# EasyEDA schematic SCH_Full_BMS_2022-05-24.json
TITLE: Sheet_1; REV: 1.0; Date: 2021-12-19; Sheet: 1/1; Drawn By: Сергей Давиденко; Company: Your Company
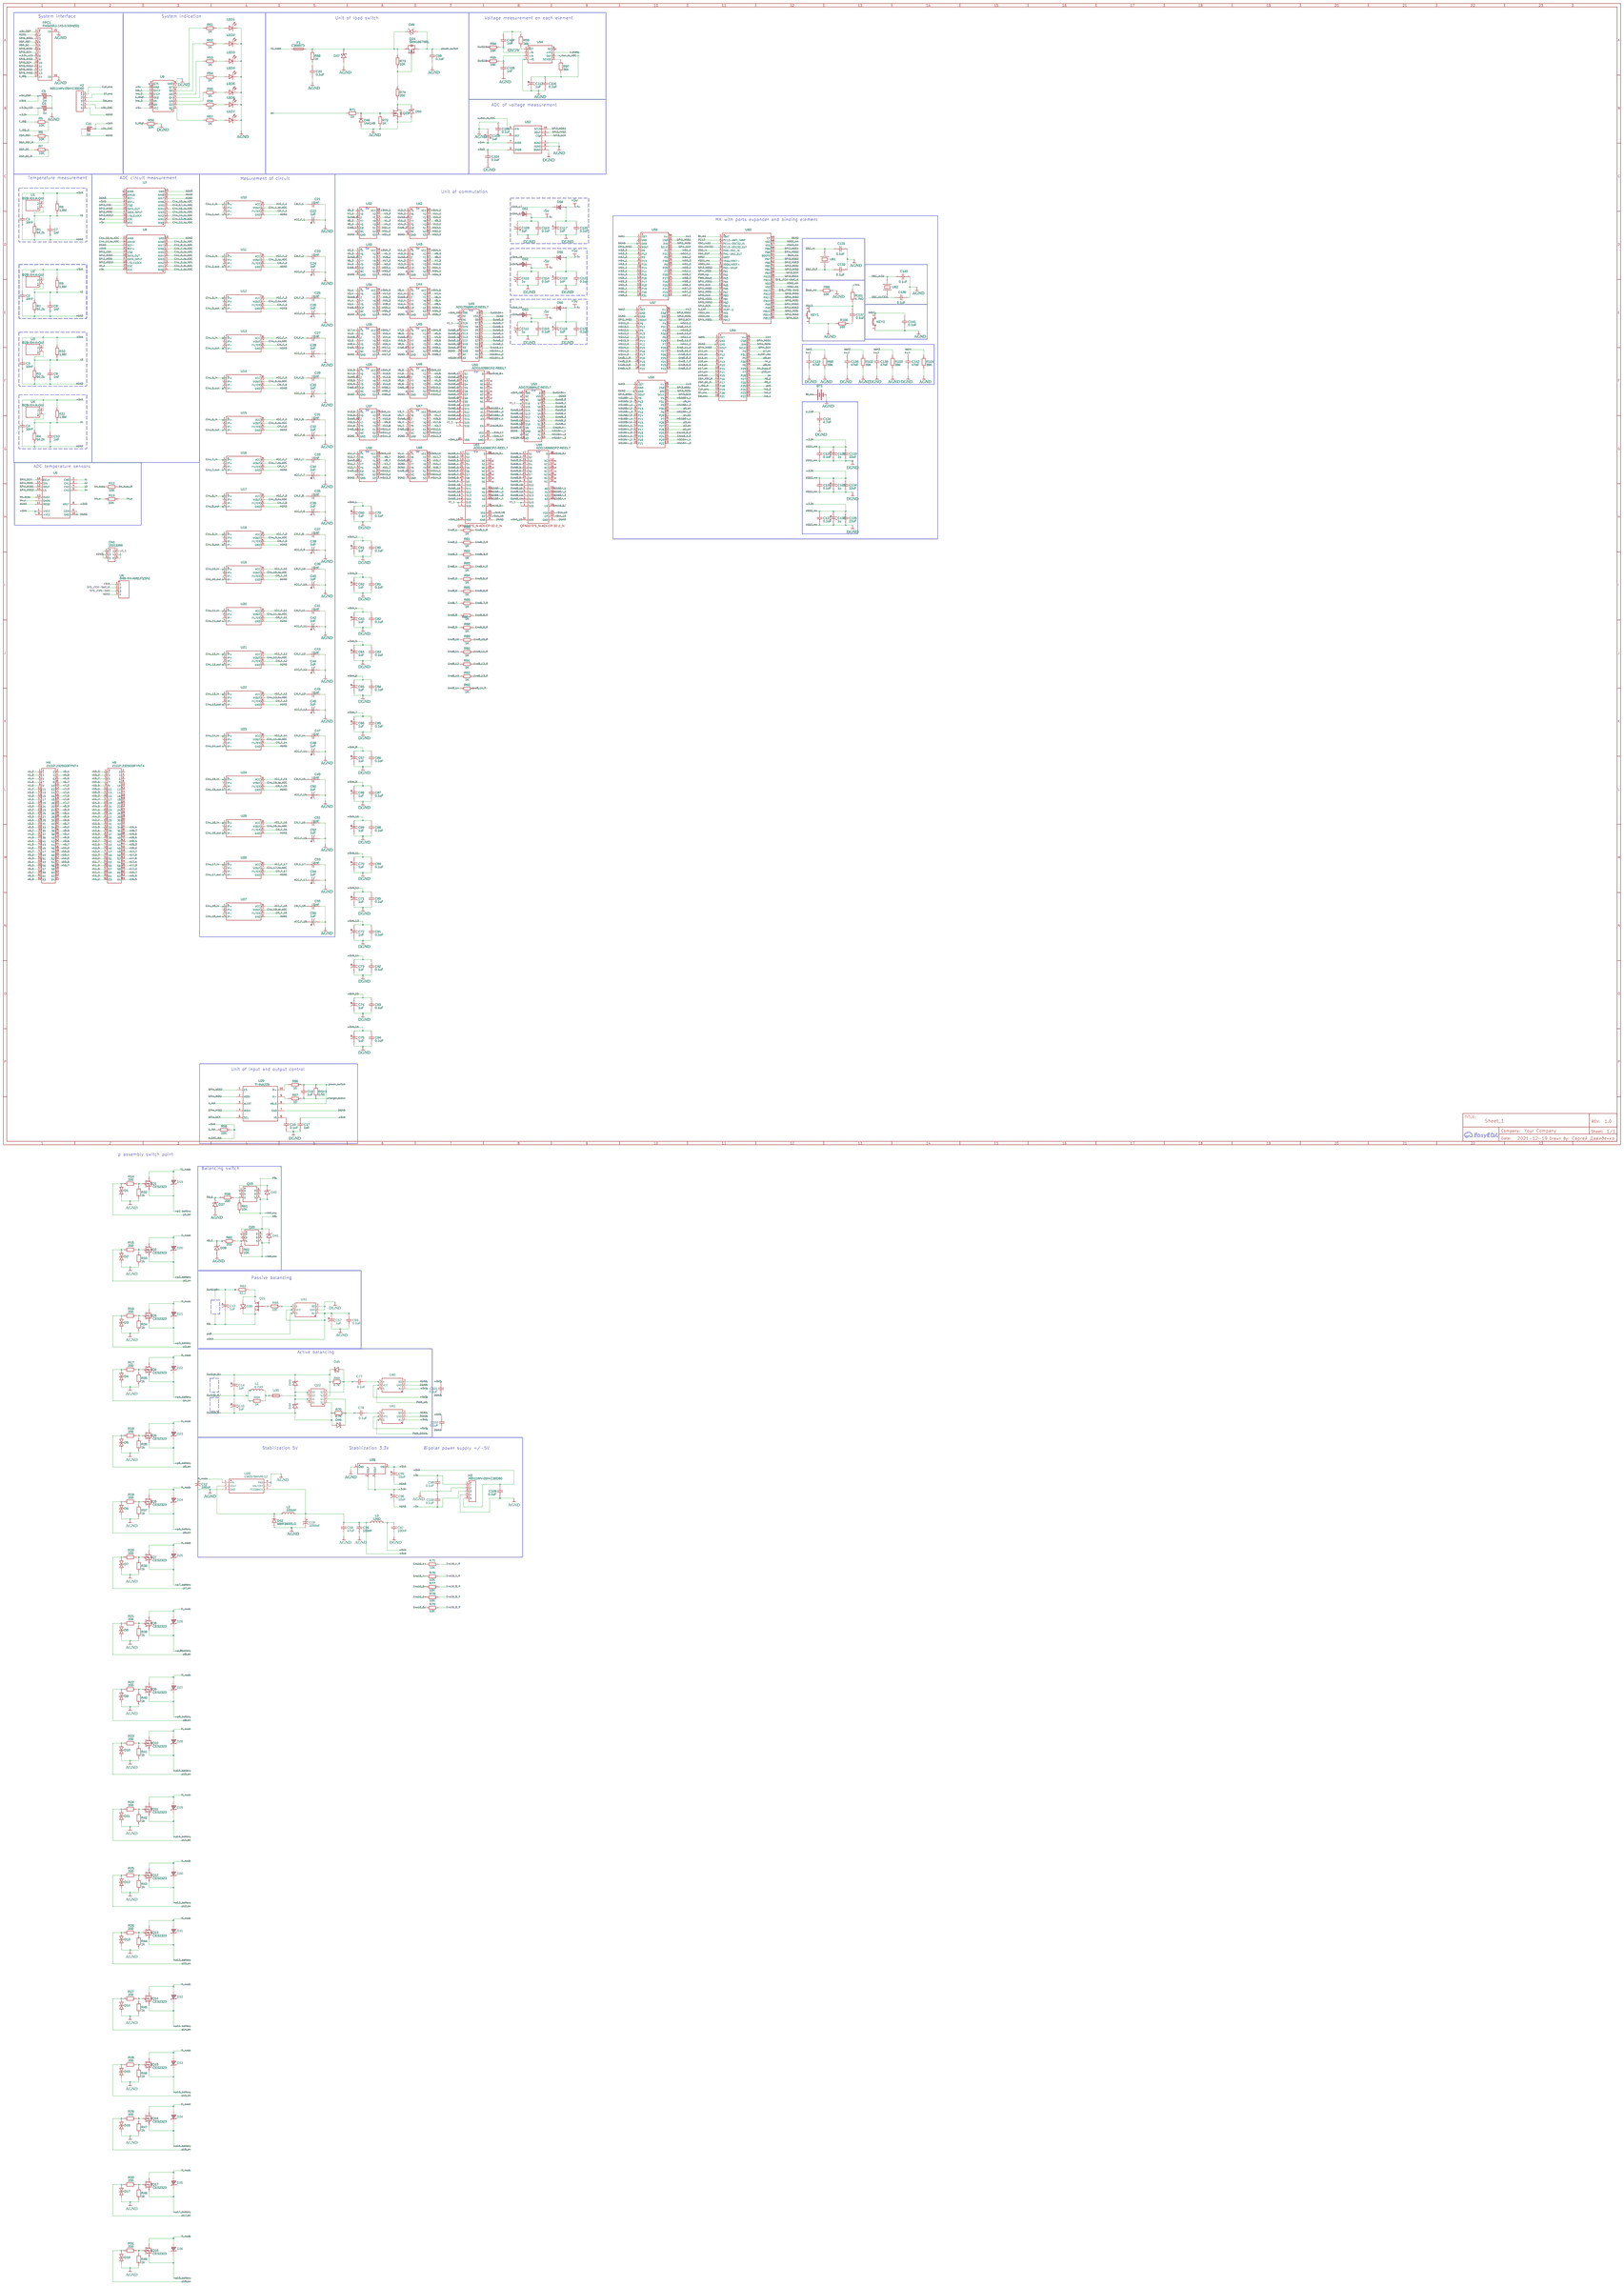
[diagram p0: schematic sheet]

## Parts
BT1  1025  [BAT-TH_KEYSTONE-1025]
C1  10nF  [C0201]
C2  10nF  [C0201]
C3  10nF  [C0201]
C4  10nF  [C0201]
C5  1u  [CASE-A_3216]
C6  1u  [CASE-A_3216]
C7  1nF  [C0201]
C8  1nF  [C0201]
C9  1nF  [C0201]
C10  1nF  [C0201]
C11  1u  [CASE-A_3216]
C12  100uF  [CAP-SMD_BD6.3-L6.6-W6.6-LS7.2-FD]
C13  1uF  [CAP-SMD_BD4.0-L4.3-W4.3-FD]
C14  1uF  [CAP-SMD_BD4.0-L4.3-W4.3-FD]
C15  1uF  [CAP-SMD_BD4.0-L4.3-W4.3-FD]
C16  0.1uF  [C0402]
C17  1uF  [C0603]
C18  1uF  [C0603]
C19  1000uF  [CAP-SMD_BD10.0-L10.3-W10.3-LS11.3-FD]
C20  0.1uF  [C0603]
C21  1nF  [C0201]
C22  1uF  [CAP-SMD_L3.2-W1.6-R-RD]
C23  1nF  [C0201]
C24  1uF  [CAP-SMD_L3.2-W1.6-R-RD]
C25  1nF  [C0201]
C26  1uF  [CAP-SMD_L3.2-W1.6-R-RD]
C27  1nF  [C0201]
C28  1uF  [CAP-SMD_L3.2-W1.6-R-RD]
C29  1nF  [C0201]
C30  1uF  [CAP-SMD_L3.2-W1.6-R-RD]
C31  1nF  [C0201]
C32  1uF  [CAP-SMD_L3.2-W1.6-R-RD]
C33  1nF  [C0201]
C34  1uF  [CAP-SMD_L3.2-W1.6-R-RD]
C35  1nF  [C0201]
C36  1uF  [CAP-SMD_L3.2-W1.6-R-RD]
C37  1nF  [C0201]
C38  1uF  [CAP-SMD_L3.2-W1.6-R-RD]
C39  1nF  [C0201]
C40  1uF  [CAP-SMD_L3.2-W1.6-R-RD]
C41  1nF  [C0201]
C42  1uF  [CAP-SMD_L3.2-W1.6-R-RD]
C43  1nF  [C0201]
C44  1uF  [CAP-SMD_L3.2-W1.6-R-RD]
C45  1nF  [C0201]
C46  1uF  [CAP-SMD_L3.2-W1.6-R-RD]
C47  1nF  [C0201]
C48  1uF  [CAP-SMD_L3.2-W1.6-R-RD]
C49  1nF  [C0201]
C50  1uF  [CAP-SMD_L3.2-W1.6-R-RD]
C51  1nF  [C0201]
C52  1uF  [CAP-SMD_L3.2-W1.6-R-RD]
C53  1nF  [C0201]
C54  1uF  [CAP-SMD_L3.2-W1.6-R-RD]
C55  1nF  [C0201]
C56  1uF  [CAP-SMD_L3.2-W1.6-R-RD]
C57  1uF  [CAP-SMD_BD4.0-L4.3-W4.3-FD]
C58  47uF  [C0805]
C59  0.1uF  [C0402]
C60  1uF  [CAP-SMD_BD4.0-L4.3-W4.3-FD]
C61  1uF  [CAP-SMD_BD4.0-L4.3-W4.3-FD]
C62  1uF  [CAP-SMD_BD4.0-L4.3-W4.3-FD]
C63  1uF  [CAP-SMD_BD4.0-L4.3-W4.3-FD]
C64  1uF  [CAP-SMD_BD4.0-L4.3-W4.3-FD]
C65  1uF  [CAP-SMD_BD4.0-L4.3-W4.3-FD]
C66  1uF  [CAP-SMD_BD4.0-L4.3-W4.3-FD]
C67  1uF  [CAP-SMD_BD4.0-L4.3-W4.3-FD]
C68  1uF  [CAP-SMD_BD4.0-L4.3-W4.3-FD]
C69  1uF  [CAP-SMD_BD4.0-L4.3-W4.3-FD]
C70  1uF  [CAP-SMD_BD4.0-L4.3-W4.3-FD]
C71  1uF  [CAP-SMD_BD4.0-L4.3-W4.3-FD]
C72  1uF  [CAP-SMD_BD4.0-L4.3-W4.3-FD]
C73  1uF  [CAP-SMD_BD4.0-L4.3-W4.3-FD]
C74  1uF  [CAP-SMD_BD4.0-L4.3-W4.3-FD]
C75  1uF  [CAP-SMD_BD4.0-L4.3-W4.3-FD]
C76  100nF  [C0201]
C77  0.1uF  [C0402]
C78  0.1uF  [C0402]
C79  0.1uF  [C0402]
C80  0.1uF  [C0402]
C81  0.1uF  [C0402]
C82  0.1uF  [C0402]
C83  0.1uF  [C0402]
C84  0.1uF  [C0402]
C85  0.1uF  [C0402]
C86  0.1uF  [C0402]
C87  0.1uF  [C0402]
C88  0.1uF  [C0402]
C89  0.1uF  [C0402]
C90  0.1uF  [C0402]
C91  0.1uF  [C0402]
C92  0.1uF  [C0402]
C93  0.1uF  [C0402]
C94  0.1uF  [C0402]
C95  10uF  [CAP-SMD_BD3.0-L3.3-W3.3-FD]
C96  10uF  [CAP-SMD_BD3.0-L3.3-W3.3-FD]
C97  100nF  [C0201]
C98  0.1uF  [C0603]
C99  0.1uF  [C0402]
C100  0.1uF  [C0402]
C101  0.1uF  [C0402]
C102  0.1uF  [C0402]
C103  1uF  [CAP-SMD_BD4.0-L4.3-W4.3-FD]
C104  0.1uF  [C0402]
C105  0.1uF  [C0402]
C106  0.1uF  [C0402]
C107  1nF  [C0201]
C108  1nF  [C0201]
C109  1uF  [CAP-SMD_BD4.0-L4.3-W4.3-FD]
C110  1u  [CASE-A_3216]
C111  1u  [CASE-A_3216]
C112  1uF  [CAP-SMD_BD4.0-L4.3-W4.3-FD]
C113  0.1uF  [C0402]
C114  0.1uF  [C0402]
C115  0.1uF  [C0402]
C116  0.1uF  [C0402]
C117  1uF  [CAP-SMD_BD4.0-L4.3-W4.3-FD]
C118  1uF  [CAP-SMD_BD4.0-L4.3-W4.3-FD]
C119  1uF  [CAP-SMD_BD4.0-L4.3-W4.3-FD]
C120  0.1uF  [C0402]
C121  0.1uF  [C0402]
C122  0.1uF  [C0402]
C123  47nF  [C0201]
C124  4.7nF  [C0201]
C125  0.1uF  [C0402]
C126  0.1uF  [C0402]
C127  0.1uF  [C0402]
C128  1u  [CAP-SMD_BD10.0-L10.3-W10.3-LS11.0-FD_16SVP180MX]
C129  1u  [CAP-SMD_BD10.0-L10.3-W10.3-LS11.0-FD_16SVP180MX]
C130  1u  [CAP-SMD_BD10.0-L10.3-W10.3-LS11.0-FD_16SVP180MX]
C131  0.1uF  [C0402]
C132  0.1uF  [C0402]
C133  22uF  [C0603]
C134  22uF  [C0603]
C135  22uF  [C0603]
C136  47nF  [C0201]
C137  0.1uF  [C0402]
C138  47nF  [C0201]
C139  0.1uF  [C0402]
C140  0.1uF  [C0402]
C141  0.1uF  [C0402]
C142  47nF  [C0201]
CN1  15311066  [CONN-TH_6P-P6.70_MOLEX_15311066]
D1  UCLAMP0541Z.TFT  [D0201-BI_1]
D2  UCLAMP0541Z.TFT  [D0201-BI_1]
D3  UCLAMP0541Z.TFT  [D0201-BI_1]
D4  UCLAMP0541Z.TFT  [D0201-BI_1]
D5  UCLAMP0541Z.TFT  [D0201-BI_1]
D6  UCLAMP0541Z.TFT  [D0201-BI_1]
D7  UCLAMP0541Z.TFT  [D0201-BI_1]
D8  UCLAMP0541Z.TFT  [D0201-BI_1]
D9  UCLAMP0541Z.TFT  [D0201-BI_1]
D10  UCLAMP0541Z.TFT  [D0201-BI_1]
D11  UCLAMP0541Z.TFT  [D0201-BI_1]
D12  UCLAMP0541Z.TFT  [D0201-BI_1]
D13  UCLAMP0541Z.TFT  [D0201-BI_1]
D14  UCLAMP0541Z.TFT  [D0201-BI_1]
D15  UCLAMP0541Z.TFT  [D0201-BI_1]
D16  UCLAMP0541Z.TFT  [D0201-BI_1]
D17  UCLAMP0541Z.TFT  [D0201-BI_1]
D18  UCLAMP0541Z.TFT  [D0201-BI_1]
D19  1.0SMBJ30A  [SMB_L4.6-W3.6-LS5.3-RD]
D20  1.0SMBJ30A  [SMB_L4.6-W3.6-LS5.3-RD]
D21  1.0SMBJ30A  [SMB_L4.6-W3.6-LS5.3-RD]
D22  1.0SMBJ30A  [SMB_L4.6-W3.6-LS5.3-RD]
D23  1.0SMBJ30A  [SMB_L4.6-W3.6-LS5.3-RD]
D24  1.0SMBJ30A  [SMB_L4.6-W3.6-LS5.3-RD]
D25  1.0SMBJ30A  [SMB_L4.6-W3.6-LS5.3-RD]
D26  1.0SMBJ30A  [SMB_L4.6-W3.6-LS5.3-RD]
D27  1.0SMBJ30A  [SMB_L4.6-W3.6-LS5.3-RD]
D28  1.0SMBJ30A  [SMB_L4.6-W3.6-LS5.3-RD]
D29  1.0SMBJ30A  [SMB_L4.6-W3.6-LS5.3-RD]
D30  1.0SMBJ30A  [SMB_L4.6-W3.6-LS5.3-RD]
D31  1.0SMBJ30A  [SMB_L4.6-W3.6-LS5.3-RD]
D32  1.0SMBJ30A  [SMB_L4.6-W3.6-LS5.3-RD]
D33  1.0SMBJ30A  [SMB_L4.6-W3.6-LS5.3-RD]
D34  1.0SMBJ30A  [SMB_L4.6-W3.6-LS5.3-RD]
D35  1.0SMBJ30A  [SMB_L4.6-W3.6-LS5.3-RD]
D36  1.0SMBJ30A  [SMB_L4.6-W3.6-LS5.3-RD]
D37  MMSZ5233BS-7-F  [SOD-323_L1.8-W1.3-LS2.5-RD]
D38  MMSZ5233BS-7-F  [SOD-323_L1.8-W1.3-LS2.5-RD]
D39  BZT52B10S RRG  [SOD-323_L1.7-W1.3-LS2.6-RD]
D40  BZT52B10S RRG  [SOD-323_L1.7-W1.3-LS2.6-RD]
D41  BZT52B10S RRG  [SOD-323_L1.7-W1.3-LS2.6-RD]
D42  MBR360RLG  [DO-201AD_BD5.3-L8.4-P12.50-D1.4-RD]
D43  PMEG3020EGWJ  [SOD-123_L2.8-W1.8-LS3.7-RD]
D44  PMEG3020EGWJ  [SOD-123_L2.8-W1.8-LS3.7-RD]
D45  PMEG3020EGWJ  [SOD-123_L2.8-W1.8-LS3.7-RD]
D46  PMEG3020EGWJ  [SOD-123_L2.8-W1.8-LS3.7-RD]
D47  PMEG3020EGWJ  [SOD-123_L2.8-W1.8-LS3.7-RD]
D48  1N4148  [DO-35_BD2.0-L4.0-P8.00-D0.5-FD]
D49  1SMAF4751A_C475445  [SMAF_L3.5-W2.6-LS4.7-RD]
D50  PMEG3020EGWJ  [SOD-123_L2.8-W1.8-LS3.7-RD]
D51  WSB5557Z-2/TR  [DFN0603-D_L0.6-W0.3-P0.34-RD]
D52  WSB5557Z-2/TR  [DFN0603-D_L0.6-W0.3-P0.34-RD]
D53  WSB5557Z-2/TR  [DFN0603-D_L0.6-W0.3-P0.34-RD]
D54  WSB5557Z-2/TR  [DFN0603-D_L0.6-W0.3-P0.34-RD]
D55  WSB5557Z-2/TR  [DFN0603-D_L0.6-W0.3-P0.34-RD]
D56  WSB5557Z-2/TR  [DFN0603-D_L0.6-W0.3-P0.34-RD]
F1  C356573  [FUSE-SMD_L6.1-W2.6]
FPC1  FH34SRJ-14S-0.5SH(50)  [FFC-SMD_14P-P0.50_FH34SRJ-14S-0.5SH]
H2  X6511WV-05H-C30D60  [HDR-TH_5P-P2.54-V-M]
H3  X6511WV-05H-C30D60  [HDR-TH_5P-P2.54-V-M]
H4  2111P-232SG0FYNT4  [HDR-TH_64P-P2.54-V-F-R2-C32-S2.54]
H5  2111P-232SG0FYNT4  [HDR-TH_64P-P2.54-V-F-R2-C32-S2.54]
KEY1  K2-3.6×6.1_SMD  [KEY-SMD_2P-L6.2-W3.6-LS8.0]
KEY2  K2-3.6×6.1_SMD  [KEY-SMD_2P-L6.2-W3.6-LS8.0]
L1  4.7uH  [IND-SMD_L4.0-W4.0]
L2  100uH  [IND-SMD_L13.1-W12.8]
L3  120Ω  [L0805]
LED1  LED-0603_R  [LED0603_RED]
LED2  LED-0603_R  [LED0603_RED]
LED3  LED-0603_R  [LED0603_RED]
LED4  LED-0603_R  [LED0603_RED]
LED5  LED-0603_R  [LED0603_RED]
LED6  LED-0603_R  [LED0603_RED]
LED7  LED-0603_R  [LED0603_RED]
Q1  CES2323  [SOT-23_L2.9-W1.3-P1.90-LS2.4-BR]
Q2  CES2323  [SOT-23_L2.9-W1.3-P1.90-LS2.4-BR]
Q3  CES2323  [SOT-23_L2.9-W1.3-P1.90-LS2.4-BR]
Q4  CES2323  [SOT-23_L2.9-W1.3-P1.90-LS2.4-BR]
Q5  CES2323  [SOT-23_L2.9-W1.3-P1.90-LS2.4-BR]
Q6  CES2323  [SOT-23_L2.9-W1.3-P1.90-LS2.4-BR]
Q7  CES2323  [SOT-23_L2.9-W1.3-P1.90-LS2.4-BR]
Q8  CES2323  [SOT-23_L2.9-W1.3-P1.90-LS2.4-BR]
Q9  CES2323  [SOT-23_L2.9-W1.3-P1.90-LS2.4-BR]
Q10  CES2323  [SOT-23_L2.9-W1.3-P1.90-LS2.4-BR]
Q11  CES2323  [SOT-23_L2.9-W1.3-P1.90-LS2.4-BR]
Q12  CES2323  [SOT-23_L2.9-W1.3-P1.90-LS2.4-BR]
Q13  CES2323  [SOT-23_L2.9-W1.3-P1.90-LS2.4-BR]
Q14  CES2323  [SOT-23_L2.9-W1.3-P1.90-LS2.4-BR]
Q15  CES2323  [SOT-23_L2.9-W1.3-P1.90-LS2.4-BR]
Q16  CES2323  [SOT-23_L2.9-W1.3-P1.90-LS2.4-BR]
Q17  CES2323  [SOT-23_L2.9-W1.3-P1.90-LS2.4-BR]
Q18  CES2323  [SOT-23_L2.9-W1.3-P1.90-LS2.4-BR]
Q19  SI1422DH-T1-GE3  [SC-70-6_L2.2-W1.3-P0.65-LS2.1-BL]
Q20  SI1422DH-T1-GE3  [SC-70-6_L2.2-W1.3-P0.65-LS2.1-BL]
Q21  MTN003N02Y3  [SOT-23-3]
Q22  FDS4897A  [SOP-8_L5.0-W4.0-P1.27-LS6.0-BL]
Q23  SM2326NSANC-TRG  [SOT-23_L2.9-W1.3-P1.90-LS2.4-BR]
Q24  SM4186T9RL  [PG-TO252-3_L6.5-W6.2-P4.57-LS10.0-BR-CW]
R1  94,2k  [R0201]
R2  94,2k  [R0201]
R3  94,2k  [R0201]
R4  94,2k  [R0201]
R5  10K  [R0603]
R6  10K  [R0603]
R7  10K  [R0603]
R8  1,6M  [R1206]
R9  1,6M  [R1206]
R10  1,6M  [R1206]
R11  1,6M  [R1206]
R12  10K  [R0603]
R13  10K  [R0603]
R14  200  [R0603]
R15  200  [R0603]
R16  200  [R0603]
R17  200  [R0603]
R18  200  [R0603]
R19  200  [R0603]
R20  200  [R0603]
R21  200  [R0603]
R22  200  [R0603]
R23  200  [R0603]
R24  200  [R0603]
R25  200  [R0603]
R26  200  [R0603]
R27  200  [R0603]
R28  200  [R0603]
R29  200  [R0603]
R30  200  [R0603]
R31  200  [R0603]
R32  1k  [R0603]
R33  1k  [R0603]
R34  1k  [R0603]
R35  1k  [R0603]
R36  1k  [R0603]
R37  1k  [R0603]
R38  1k  [R0603]
R39  1k  [R0603]
R40  1k  [R0603]
R41  1k  [R0603]
R42  1k  [R0603]
R43  1k  [R0603]
R44  1k  [R0603]
R45  1k  [R0603]
R46  1k  [R0603]
R47  1k  [R0603]
R48  1k  [R0603]
R49  1k  [R0603]
R50  10K  [R0603]
R51  1K  [R1206]
R52  1K  [R1206]
R53  1K  [R1206]
R54  1K  [R1206]
R55  1K  [R1206]
R56  1K  [R1206]
R57  1K  [R1206]
R58  10K  [R0402]
R59  200  [R1206]
R60  200  [R1206]
R61  10K  [R0201]
R62  10K  [R0201]
R63  42.2  [R2512]
R64  1K  [R1218]
R65  100  [R1206]
R66  10  [R1206]
R67  10  [R1206]
R68  1K  [R1206]
R69  4.7K  [R0402]
R70  4.7K  [R0402]
R71  1K  [R1206]
R72  1K  [R1206]
R73  10K  [R0603]
R74  200  [R1206]
R75  10K  [R0201]
R76  10K  [R0201]
R77  10K  [R0201]
R78  10K  [R0201]
R79  10K  [R0201]
R80  1K  [R0201]
R81  1K  [R0201]
R82  1K  [R0201]
R83  1K  [R0201]
R84  1K  [R0201]
R85  1K  [R0201]
R86  1K  [R0201]
R87  1K  [R0201]
R88  1K  [R0201]
R89  1K  [R0201]
R90  1K  [R0201]
R91  1K  [R0201]
R92  1K  [R0201]
R93  1K  [R0201]
R94  16K  [R1206]
R95  16K  [R1206]
R96  36k  [R1206]
R97  36k  [R1206]
R98  39K  [R0805]
R99  10K  [R0603]
R100  100  [R1206]
R101  4.7kΩ  [R0805]
R102  39K  [R0805]
R103  39K  [R0805]
R104  39K  [R0805]
RSH1  0.55  [R0603]
U1  B2B-XH-A-GU  [CONN-TH_B2B-XH-A-GU]
U2  B2B-XH-A-GU  [CONN-TH_B2B-XH-A-GU]
U3  B2B-XH-A-GU  [CONN-TH_B2B-XH-A-GU]
U4  B2B-XH-A-GU  [CONN-TH_B2B-XH-A-GU]
U5  ADS7841E/2K5  [SSOP-16_L4.9-W3.9-P0.64-LS6.0-BL]
U6  B4B-XH-AM(LF)(SN)  [CONN-TH_B4B-XH-AM-LF-SN]
U7  TLC2543N  [DIP-20_L26.8-W6.4-P2.54-LS7.6-BL]
U8  TLC2543N  [DIP-20_L26.8-W6.4-P2.54-LS7.6-BL]
U9  74HC595PW,112  [TSSOP-16_L5.0-W4.4-P0.65-LS6.4-BL]
U10  ACS714LLCTR-50A-T  [SOIC-8_L5.0-W4.0-P1.27-LS6.0-TL]
U11  ACS714LLCTR-50A-T  [SOIC-8_L5.0-W4.0-P1.27-LS6.0-TL]
U12  ACS714LLCTR-50A-T  [SOIC-8_L5.0-W4.0-P1.27-LS6.0-TL]
U13  ACS714LLCTR-50A-T  [SOIC-8_L5.0-W4.0-P1.27-LS6.0-TL]
U14  ACS714LLCTR-50A-T  [SOIC-8_L5.0-W4.0-P1.27-LS6.0-TL]
U15  ACS714LLCTR-50A-T  [SOIC-8_L5.0-W4.0-P1.27-LS6.0-TL]
U16  ACS714LLCTR-50A-T  [SOIC-8_L5.0-W4.0-P1.27-LS6.0-TL]
U17  ACS714LLCTR-50A-T  [SOIC-8_L5.0-W4.0-P1.27-LS6.0-TL]
U18  ACS714LLCTR-50A-T  [SOIC-8_L5.0-W4.0-P1.27-LS6.0-TL]
U19  ACS714LLCTR-50A-T  [SOIC-8_L5.0-W4.0-P1.27-LS6.0-TL]
U20  ACS714LLCTR-50A-T  [SOIC-8_L5.0-W4.0-P1.27-LS6.0-TL]
U21  ACS714LLCTR-50A-T  [SOIC-8_L5.0-W4.0-P1.27-LS6.0-TL]
U22  ACS714LLCTR-50A-T  [SOIC-8_L5.0-W4.0-P1.27-LS6.0-TL]
U23  ACS714LLCTR-50A-T  [SOIC-8_L5.0-W4.0-P1.27-LS6.0-TL]
U24  ACS714LLCTR-50A-T  [SOIC-8_L5.0-W4.0-P1.27-LS6.0-TL]
U25  ACS714LLCTR-50A-T  [SOIC-8_L5.0-W4.0-P1.27-LS6.0-TL]
U26  ACS714LLCTR-50A-T  [SOIC-8_L5.0-W4.0-P1.27-LS6.0-TL]
U27  ACS714LLCTR-50A-T  [SOIC-8_L5.0-W4.0-P1.27-LS6.0-TL]
U28  LM2576HVR-12  [TO-263-5_L10.2-W8.6-P1.70-LS14.4-TL]
U29  TI INA229  [TI INA229]
U30  0435002.KR  [F0402]
U31  NLAS4157DFT2G  [SC-88-6_L2.0-W1.3-P0.65-LS2.1-BL]
U32  NX3L4051PW,118  [TSSOP-16_L5.0-W4.4-P0.65-LS6.4-TL]
U33  NX3L4051PW,118  [TSSOP-16_L5.0-W4.4-P0.65-LS6.4-TL]
U34  NX3L4051PW,118  [TSSOP-16_L5.0-W4.4-P0.65-LS6.4-TL]
U35  NX3L4051PW,118  [TSSOP-16_L5.0-W4.4-P0.65-LS6.4-TL]
U36  NX3L4051PW,118  [TSSOP-16_L5.0-W4.4-P0.65-LS6.4-TL]
U37  NX3L4051PW,118  [TSSOP-16_L5.0-W4.4-P0.65-LS6.4-TL]
U38  NX3L4051PW,118  [TSSOP-16_L5.0-W4.4-P0.65-LS6.4-TL]
U39  AIC1117A-25GYTR  [SOT-223_L6.5-W3.5-P2.30-LS7.0-BR]
U40  NLAS4157DFT2G  [SC-88-6_L2.0-W1.3-P0.65-LS2.1-BL]
U41  NLAS4157DFT2G  [SC-88-6_L2.0-W1.3-P0.65-LS2.1-BL]
U42  NX3L4051PW,118  [TSSOP-16_L5.0-W4.4-P0.65-LS6.4-TL]
U43  NX3L4051PW,118  [TSSOP-16_L5.0-W4.4-P0.65-LS6.4-TL]
U44  NX3L4051PW,118  [TSSOP-16_L5.0-W4.4-P0.65-LS6.4-TL]
U45  NX3L4051PW,118  [TSSOP-16_L5.0-W4.4-P0.65-LS6.4-TL]
U46  NX3L4051PW,118  [TSSOP-16_L5.0-W4.4-P0.65-LS6.4-TL]
U47  NX3L4051PW,118  [TSSOP-16_L5.0-W4.4-P0.65-LS6.4-TL]
U48  NX3L4051PW,118  [TSSOP-16_L5.0-W4.4-P0.65-LS6.4-TL]
U49  ADG706BRUZ-REEL7  [TSSOP-28_L9.7-W4.4-P0.65-LS6.4-BL]
U50  ADG1406BCPZ-REEL7  [QFN32-5*5_N-ADI-CP-32-2_N]
U51  ADG1406BCPZ-REEL7  [QFN32-5*5_N-ADI-CP-32-2_N]
U52  MAX11100EUB+  [MSOP-10_L3.0-W3.0-P0.50-LS5.0-BL]
U53  ADG706BRUZ-REEL7  [TSSOP-28_L9.7-W4.4-P0.65-LS6.4-BL]
U54  AD8278ARZ-R7  [SOIC-8_L5.0-W4.0-P1.27-LS6.0-BL]
U55  ADG1406BCPZ-REEL7  [QFN32-5*5_N-ADI-CP-32-2_N]
U56  MAX7301AAX+  [SSOP-36_L15.4-W7.5-P0.80-LS10.3-BL]
U57  MAX7301AAX+  [SSOP-36_L15.4-W7.5-P0.80-LS10.3-BL]
U58  MAX7301AAX+  [SSOP-36_L15.4-W7.5-P0.80-LS10.3-BL]
U59  MAX7301AAX+  [SSOP-36_L15.4-W7.5-P0.80-LS10.3-BL]
U60  STM32F411CCU6TR  [QFN-48_L7.0-W7.0-P0.50-BL-EP5.1]
U61  SMAQ-7050A  [IQG7050A]
U62  SMAQ-7050A  [IQG7050A]

## Library data of the parts
BT1 = 1025: Supplier: LCSC; Supplier Part: C238060; Manufacturer: Keystone; Contributor: LCSC; JLCPCB Part Class: Extended Part; Package Display: No
C1-C4 C7-C10 = GRM033R71A103KA01D: Supplier: LCSC; Manufacturer: MuRata; Supplier Part: C76941
C5 C6 C11 = C_Tan_SMD_A_EU: Contributor: LCEDA_Lib
C12 = HV101M035E077R: Supplier: LCSC; Manufacturer: CapXon; Supplier Part: C59934; JLCPCB Part Class: Extended Part
C13-C15 C57 C60-C75 C103 C109 C112 C117-C119 = VE-010M1C0405-TRO: Supplier: LCSC; Supplier Part: C249445; Manufacturer: Lelon; Contributor: LCSC; JLCPCB Part Class: Extended Part; Package Display: No
C16 C59 C77-C94 C99-C102 C104-C106 C113-C116 C120-C122 C125-C127 C131 C132 C137 C139-C141 = 0402BB104K160NGT: Supplier: LCSC; Supplier Part: C2173076; Manufacturer: Knowles(楼氏); JLCPCB Part Class: Extended Part; Contributor: LCSC; Package Display: No
C17 C18 = CL10F105ZP8NNNC: Supplier: LCSC; Manufacturer: SAMSUNG; Supplier Part: C84710; JLCPCB Part Class: Extended Part; Package Display: No
C19 = RVT1C102M1010: Supplier: LCSC; Manufacturer: ROQANG; Supplier Part: C72470; JLCPCB Part Class: Extended Part
C20 C98 = 0603BB104K500NGT: Supplier: LCSC; Supplier Part: C2168571; Manufacturer: Knowles(楼氏); JLCPCB Part Class: Extended Part; Contributor: LCSC; Package Display: No
C21 C23 C25 C27 C29 C31 C33 C35 C37 C39 C41 C43 C45 C47 C49 C51 C53 C55 C107 C108 = 0201B102J500CT: Supplier: LCSC; Supplier Part: C458605; Manufacturer: Walsin Tech Corp; Contributor: LCSC
C22 C24 C26 C28 C30 C32 C34 C36 C38 C40 C42 C44 C46 C48 C50 C52 C54 C56 = CA45-A-16V-1UF-K: Supplier: LCSC; Supplier Part: C140386; Manufacturer: Shenzhen Zhenhua XinYun Elec; Manufacturer Part: CA45-A-16V-1uF-K; Contributor: LCSC; JLCPCB Part Class: Extended Part
C58 = 0805X476M6R3: Supplier: LCSC; Manufacturer: WTC; Supplier Part: C98821; Package Display: No
C76 C97 = C0201X6S104K6R3NTA: Supplier: LCSC; Supplier Part: C357757; Manufacturer: Shenzhen Eyang Tech Development; Contributor: LCSC; Package Display: No
C95 C96 = VE-100M0J0305-TRO: Supplier: LCSC; Supplier Part: C249448; Manufacturer: Lelon; Contributor: LCSC; JLCPCB Part Class: Extended Part; Package Display: No
C110 C111 = C_Tan_SMD_A_US: Contributor: LCEDA_Lib; Package Display: No
C123 C136 C138 C142 = GRT033R60J473KE01D: Supplier: LCSC; Supplier Part: C126621; Manufacturer: Murata Electronics; Contributor: LCSC; JLCPCB Part Class: Extended Part; Package Display: No
C124 = CC0201KRX7R5BB472: Supplier: LCSC; Supplier Part: C526949; Manufacturer: YAGEO; Contributor: LCSC; Package Display: No
C128-C130 = 16SVP180MX: Supplier: LCSC; Supplier Part: C236288; Manufacturer: PANASONIC; Contributor: LCSC; JLCPCB Part Class: Extended Part
C133-C135 = GRM188B30J226MEA0D: Supplier: LCSC; Manufacturer: MuRata; Supplier Part: C15500; JLCPCB Part Class: Extended Part; Package Display: No
CN1 = 15311066: Supplier: LCSC; Supplier Part: C585772; Manufacturer: MOLEX; Contributor: LCSC
D1-D18 = UCLAMP0541Z.TFT: Supplier: LCSC; Supplier Part: C193630; Manufacturer: SEMTECH; Contributor: LCSC; JLCPCB Part Class: Extended Part; Package Display: No
D19-D36 = 1.0SMBJ20A: Supplier: LCSC; Supplier Part: C501367; Manufacturer: Me-TECH; Contributor: LCSC; JLCPCB Part Class: Extended Part
D37 D38 = MMSZ5233BS-7-F: Supplier: LCSC; Supplier Part: C508230; Manufacturer: Diodes Incorporated; Contributor: LCSC; JLCPCB Part Class: Extended Part; Package Display: No
D39-D41 = BZT52B10S RRG: Supplier: LCSC; Supplier Part: C485479; Manufacturer: Taiwan Semiconductor(Taiwan Semicon); Contributor: LCSC; JLCPCB Part Class: Extended Part; Package Display: No
D42 = MBR360RLG: Supplier: LCSC; Supplier Part: C232634; Manufacturer: ON Semicon; Contributor: LCSC; JLCPCB Part Class: Extended Part
D43-D47 D50 = PMEG3020EGWJ: Supplier: LCSC; Supplier Part: C552875; Manufacturer: Nexperia; Contributor: LCSC; JLCPCB Part Class: Extended Part
D48 = 1N4148: Supplier: LCSC; Manufacturer: SEMTECH; Supplier Part: C14516; Contributor: LCEDA_Lib; Package Display: No
D49 = 1SMAF4751A_C475445: Supplier: LCSC; Supplier Part: C475445; Manufacturer: Shikues; Manufacturer Part: 1SMAF4751A; Contributor: LCSC; JLCPCB Part Class: Extended Part; Package Display: No
D51-D56 = WSB5557Z-2/TR: Supplier: LCSC; Supplier Part: C239812; Manufacturer: Will Semicon; Contributor: LCSC; JLCPCB Part Class: Extended Part; Package Display: No
F1 = 25F-100H: Supplier: LCSC; Manufacturer: HOLLY; Contributor: LCSC; JLCPCB Part Class: Extended Part
FPC1 = FH34SRJ-14S-0.5SH(50): Supplier: LCSC; Supplier Part: C324724; Manufacturer: Hirose; Contributor: LCSC; JLCPCB Part Class: Extended Part
H2 H3 = X6511WV-05H-C30D60: Supplier: LCSC; Supplier Part: C706877; Manufacturer: XKB Connectivity; Contributor: LCSC; JLCPCB Part Class: Extended Part
H4 H5 = 2111P-232SG0FYNT4: Supplier: LCSC; Supplier Part: C721780; Manufacturer: Wcon; Contributor: LCSC; JLCPCB Part Class: Extended Part
KEY1 KEY2 = K2-3.6×6.1_SMD: Supplier Part: C118141; Supplier: LCSC; Manufacturer Part: K2-1107ST-A4SW-06; Contributor: LCEDA_Lib; 制造商: 韩国韩荣; Package Display: No
L1 = CKCS4030-4.7UH/M-2131: Supplier: LCSC; Supplier Part: C354588; Manufacturer: CENKER; Manufacturer Part: CKCS4030-4.7uH/M-2131; Contributor: LCSC
L2 = CDRH12D77BT150NP-470MC: Supplier: LCSC; Supplier Part: C171600; Manufacturer: Sumida; Contributor: LCSC; JLCPCB Part Class: Extended Part
L3 = BLM21PG121SZ1D: Supplier: LCSC; Manufacturer: MuRata; Contributor: LCSC; Supplier Part: C160987; JLCPCB Part Class: Extended Part; Package Display: No
LED1-LED7 = LED-0603_R: Manufacturer: EVERLIGHT(台湾亿光); Manufacturer Part: 19-217/R6C-AL1M2VY/3T; Supplier Part: C72044; Supplier: LCSC; Contributor: LCEDA_01
Q1-Q18 = CES2323: Supplier: LCSC; Manufacturer: CET; Contributor: LCSC; Supplier Part: C83044; JLCPCB Part Class: Extended Part; Package Display: No
Q19 Q20 = SI1422DH-T1-GE3: Supplier: LCSC; Manufacturer: VISHAY; Contributor: LCSC; Supplier Part: C144842; JLCPCB Part Class: Extended Part; Package Display: No
Q21 = SLS2302: Contributor: Jesseprominer
Q22 = FDS4897A: Supplier: LCSC; Supplier Part: C693180; Manufacturer: VBsemi Elec; Contributor: LCSC; JLCPCB Part Class: Extended Part
Q23 = SM2326NSANC-TRG: Supplier: LCSC; Supplier Part: C368561; Manufacturer: Sinopower Semicon; Contributor: LCSC; JLCPCB Part Class: Extended Part; Package Display: No
Q24 = SM4186T9RL: Supplier: LCSC; Supplier Part: C496601; Manufacturer: SPS; Contributor: LCSC; JLCPCB Part Class: Extended Part; Package Display: No
R1-R4 = WR02X1873FAL: Supplier: LCSC; Supplier Part: C171920; Manufacturer: Huaxin S&T; Contributor: LCSC; JLCPCB Part Class: Extended Part; Package Display: No
R5-R7 R12 R13 R50 R73 R99 = 0603WAF1002T5E: Supplier: LCSC; Manufacturer: UniOhm; Supplier Part: C25804; JLCPCB Part Class: Basic Part; Package Display: No
R8-R11 = CR1206-FX-1603ELF: Supplier: LCSC; Supplier Part: C204681; Manufacturer: BOURNS; Contributor: LCSC; JLCPCB Part Class: Extended Part; Package Display: No
R14-R49 RSH1 = R_0603_EU: Contributor: LCEDA_Lib
R51-R57 R68 = CR1206F41001G: Supplier: LCSC; Manufacturer: LIZ; Supplier Part: C102060; JLCPCB Part Class: Extended Part; Package Display: No
R58 = RNCF0402BTE10K0: Supplier: LCSC; Supplier Part: C346559; Manufacturer: Stackpole Elec; Contributor: LCSC; JLCPCB Part Class: Extended Part; Package Display: No
R59 R60 R74 = RMC12062005%N: Supplier: LCSC; Supplier Part: C269602; Manufacturer: Tyohm; Contributor: LCSC; JLCPCB Part Class: Extended Part; Package Display: No
R61 R62 R75-R93 = RC-01W103JT: Supplier: LCSC; Supplier Part: C304504; Manufacturer: Guangdong Fenghua Advanced Tech; Contributor: LCSC; Package Display: No
R63 = RC-12K42R2FT: Supplier: LCSC; Supplier Part: C454007; Manufacturer: FH(Guangdong Fenghua Advanced Tech); Contributor: LCSC; Package Display: No
R64 = TR1218F1KE0450: Supplier: LCSC; Supplier Part: C175641; Manufacturer: Ever Ohms Tech; Contributor: LCSC; JLCPCB Part Class: Extended Part; Package Display: No
R65 = FCR1206J100RP055W: Supplier: LCSC; Supplier Part: C153338; Manufacturer: Ever Ohms Tech; Contributor: LCSC; JLCPCB Part Class: Extended Part; Package Display: No
R66 R67 = RMC1206101%N: Supplier: LCSC; Supplier Part: C269633; Manufacturer: Tyohm; Contributor: LCSC; JLCPCB Part Class: Extended Part; Package Display: No
R69 R70 = ERJPA2J472X: Supplier: LCSC; Supplier Part: C427213; Manufacturer: PANASONIC; Contributor: LCSC; Package Display: No
R71 R72 = RMC12061K5%N: Supplier: LCSC; Supplier Part: C269755; Manufacturer: Tyohm; Contributor: LCSC; JLCPCB Part Class: Extended Part; Package Display: No
R94 R95 = CR1206-FX-1602ELF: Supplier: LCSC; Supplier Part: C204680; Manufacturer: BOURNS; Contributor: LCSC; JLCPCB Part Class: Extended Part; Package Display: No
R96 R97 = RK73H2BTTD3602F: Supplier: LCSC; Supplier Part: C880208; Manufacturer: KOA Speer Elec; Contributor: LCSC; Package Display: No
R98 R102-R104 = ERJ6ENF3902V: Supplier: LCSC; Supplier Part: C413307; Manufacturer: PANASONIC; Contributor: LCSC; Package Display: No
R100 = CR1206F100RP05: Supplier: LCSC; Supplier Part: C245445; Manufacturer: Ever Ohms Tech; Contributor: LCSC; JLCPCB Part Class: Extended Part; Package Display: No
R101 = RK73G2ATTD4701F: Supplier: LCSC; Supplier Part: C516091; Manufacturer: KOA Speer Elec; Contributor: LCSC; Package Display: No
U1-U4 = B2B-XH-A-GU: Supplier: LCSC; Supplier Part: C265283; Manufacturer: JST Sales America; Contributor: LCSC; JLCPCB Part Class: Extended Part
U5 = ADS7841E/2K5: Supplier: LCSC; Manufacturer: TI; Supplier Part: C41778; JLCPCB Part Class: Extended Part; Package Display: No
U6 = B4B-XH-AM(LF)(SN): Supplier: LCSC; Supplier Part: C161871; Manufacturer: JST Sales America; Contributor: LCSC; JLCPCB Part Class: Extended Part
U7 U8 = TLC2543N: Supplier: LCSC; Supplier Part: C398066; Manufacturer: HGSEMI; Contributor: LCSC; JLCPCB Part Class: Extended Part; Package Display: No
U9 = 74HC595PW,112: Supplier: LCSC; Supplier Part: C547128; Manufacturer: Nexperia; Contributor: LCSC; JLCPCB Part Class: Extended Part
U10-U27 = ACS714LLCTR-50A-T: Supplier: LCSC; Supplier Part: C163302; Manufacturer: Allegro MicroSystems, LLC; Contributor: LCSC; JLCPCB Part Class: Extended Part
U28 = LM2576HVR-12: Supplier: LCSC; Manufacturer: HTC; Supplier Part: C126036; JLCPCB Part Class: Extended Part
U29 = TI INA229: Manufacturer: Texas Instruments; Manufacturer Part: INA229; link: http://www.ti.com/product/INA229-Q1?dcmp=dsproject&hqs=pf; Contributor: part.jackpot
U30 = 0435002.KR: Supplier: LCSC; Supplier Part: C206948; Manufacturer: Littelfuse; Contributor: LCSC; JLCPCB Part Class: Extended Part; Package Display: No
U31 U40 U41 = NLAS4157DFT2G: Supplier: LCSC; Supplier Part: C106912; Manufacturer: ON Semicon; Contributor: LCSC; JLCPCB Part Class: Extended Part
U32-U38 U42-U48 = NX3L4051PW,118: Supplier: LCSC; Supplier Part: C2673441; Manufacturer: NXP(恩智浦); Contributor: LCSC; JLCPCB Part Class: Extended Part; Package Display: No
U39 = AIC1117A-25GYTR: Supplier: LCSC; Supplier Part: C238209; Manufacturer: Analog Integrations; Contributor: LCSC; JLCPCB Part Class: Extended Part; Package Display: No
U49 U53 = ADG706BRUZ-REEL7: Supplier: LCSC; Supplier Part: C408400; Manufacturer: Analog Devices; Contributor: LCSC; JLCPCB Part Class: Extended Part; Package Display: No
U50 = ADG1406BCPZ-REEL7: 9.5 Ohm Ron, 16-Channel, +-15 V  +12 V  +-5 V iCMOS Multiplexer, 32-pin QFN (CP-32-2), Reel; Package Display: No
U51 U55 = ADG1406BCPZ-REEL7: 9.5 Ohm Ron, 16-Channel, +-15 V  +12 V  +-5 V iCMOS Multiplexer, 32-pin QFN (CP-32-2), Reel; Package Display: Yes
U52 = MAX11100EUB+: Supplier: LCSC; Manufacturer: MAXIM; Contributor: LCSC; Supplier Part: C143329; JLCPCB Part Class: Extended Part; Package Display: No
U54 = AD8278ARZ-R7: Supplier: LCSC; Supplier Part: C652635; Manufacturer: Analog Devices; Contributor: LCSC; JLCPCB Part Class: Extended Part; Package Display: No
U56-U59 = MAX7301AAX+: Supplier: LCSC; Manufacturer: MAXIM; Contributor: LCSC; Supplier Part: C143583; JLCPCB Part Class: Extended Part; Package Display: No
U60 = STM32F411CCU6TR: Supplier: LCSC; Supplier Part: C190642; Manufacturer: STMicroelectronics; Contributor: LCSC; JLCPCB Part Class: Extended Part
U61 U62 = SMAQ-7050A: Package Display: No

## Nets
+3.3V: C96.1 C125.2 C126.2 C127.2 C128.1 C129.1 C130.1 C133.2 C134.2 C135.2 U39.2(VOUT) U39.4(VOUT) U60.9(VDDA/VREF+) U60.24(VDD) U60.36(VDD) U60.48(VDD)
+3.3v: C6.1 FPC1.8
+5v: C99.2 C117.1 C118.1 C119.1 C120.2 C121.2 C122.2 D54.2(A) D55.2(A) D56.2(A) H3.1 U7.20(VCC) U8.20(VCC) U9.10(MR#) U9.16(VCC)
+5VA: C1.1 C2.1 C3.1 C4.1 C5.1 C11.1 C17.2 C19.1 C57.1 C58.2 C59.2 C76.1 C95.1 C103.1 C106.2 FPC1.1 H2.4 H3.5 L2.2 L3.1 R8.2 R9.2 R10.2 R11.2 R58.1 R101.2 U1.2 U2.2 U3.2 U4.2 U5.1(+VCC) U5.9(+VCC) U6.1 U28.4(FEEDBACK) U31.1(B1) U31.5(VCC) U39.3(VIN) U40.1(B1) U41.1(B1) U52.7(AVDD) U59.31(P31)
+5VA_1: C60.1 C79.2 U32.16(VCC)
+5VA_2: C61.1 C80.2 U42.16(VCC)
+5VA_3: C62.1 C81.2 U33.16(VCC)
+5VA_4: C63.1 C82.2 U43.16(VCC)
+5VA_5: C64.1 C83.2 U34.16(VCC)
+5VA_6: C65.1 C84.2 U44.16(VCC)
+5VA_7: C66.1 C85.2 U35.16(VCC)
+5VA_8: C67.1 C86.2 U45.16(VCC)
+5VA_9: C68.1 C87.2 U36.16(VCC)
+5VA_10: C69.1 C88.2 U46.16(VCC)
+5VA_11: C70.1 C89.2 U37.16(VCC)
+5VA_12: C71.1 C90.2 U47.16(VCC)
+5VA_13: C72.1 C91.2 U38.16(VCC)
+5VA_14: C73.1 C92.2 U48.16(VCC)
+5VA_15: C74.1 C93.2 U49.1(VDD)
+5VA_16: C75.1 C94.2 U53.1(VDD)
+5VA_17: D54.1(K) U50.31(VDD)
+5VA_18: D55.1(K) U51.31(VDD)
+5VA_19: D56.1(K) U55.31(VDD)
+5VD: C97.1 C101.2 C102.2 C104.2 L3.2 U5.8(VREF) U7.14(REF+) U8.14(REF+) U40.5(VCC) U41.5(VCC) U52.3(DVDD)
-5v: C100.1 C109.2 C110.2 C111.2 C113.2 C114.2 C115.2 D51.1(K) D52.1(K) D53.1(K) H3.3
-5VA_17: D51.2(A) U50.25(VSS) U50.33(EP)
-5VA_18: D52.2(A) U51.25(VSS) U51.33(EP)
-5VA_19: D53.2(A) U55.25(VSS) U55.33(EP)
AGND: BT1.2(-) C1.2 C2.2 C3.2 C4.2 C5.2 C6.2 C7.2 C8.2 C9.2 C10.2 C11.2 C12.2 C19.2 C20.1 C21.2 C22.2 C23.2 C24.2 C25.2 C26.2 C27.2 C28.2 C29.2 C30.2 C31.2 C32.2 C33.2 C34.2 C35.2 C36.2 C37.2 C38.2 C39.2 C40.2 C41.2 C42.2 C43.2 C44.2 C45.2 C46.2 C47.2 C48.2 C49.2 C50.2 C51.2 C52.2 C53.2 C54.2 C55.2 C56.2 C57.2 C58.1 C59.1 C76.2 C95.2 C96.2 C98.1 C99.1 C100.2 C103.2 C105.2 C106.1 C107.2 C108.1 C112.2 C116.1 C131.2 C132.2 C139.2 C140.2 C141.1 CN1.1 CN1.3 CN1.5 D1.1(K) D2.1(K) D3.1(K) D4.1(K) D5.1(K) D6.1(K) D7.1(K) D8.1(K) D9.1(K) D10.1(K) D11.1(K) D12.1(K) D13.1(K) D14.1(K) D15.1(K) D16.1(K) D17.1(K) D18.1(K) D37.2(A) D38.2(A) D42.2 D47.2(A) D48.1 D50.2(A) FPC1.2 FPC1.15 FPC1.16 H2.5 H3.2 H3.4 KEY1.1 KEY2.1 LED1.2 LED2.2 LED3.2 LED4.2 LED5.2 LED6.2 LED7.2 Q23.2(S) R1.1 R2.1 R3.1 R4.1 R32.2 R33.2 R34.2 R35.2 R36.2 R37.2 R38.2 R39.2 R40.2 R41.2 R42.2 R43.2 R44.2 R45.2 R46.2 R47.2 R48.2 R49.2 R72.1 R96.2 R98.1 R99.2 R100.1 R102.1 R103.1 R104.1 U5.11(MODE) U6.4 U7.8(AIN7) U7.9(AIN8) U7.10(GND) U8.10(GND) U10.5(GND) U11.5(GND) U12.5(GND) U13.5(GND) U14.5(GND) U15.5(GND) U16.5(GND) U17.5(GND) U18.5(GND) U19.5(GND) U20.5(GND) U21.5(GND) U22.5(GND) U23.5(GND) U24.5(GND) U25.5(GND) U26.5(GND) U27.5(GND) U28.3(GND) U28.5(ON/OFF) U28.6(PAD) U39.1(GND) U40.3(B0) U41.3(B0) U52.4(AGND) U52.8(AGND) U54.4(-VS)
DGND: C16.1 C17.1 C60.2 C61.2 C62.2 C63.2 C64.2 C65.2 C66.2 C67.2 C68.2 C69.2 C70.2 C71.2 C72.2 C73.2 C74.2 C75.2 C79.1 C80.1 C81.1 C82.1 C83.1 C84.1 C85.1 C86.1 C87.1 C88.1 C89.1 C90.1 C91.1 C92.1 C93.1 C94.1 C97.2 C101.1 C102.1 C104.1 C109.1 C110.1 C111.1 C113.1 C114.1 C115.1 C117.2 C118.2 C119.2 C120.1 C121.1 C122.1 C123.1 C124.1 C125.1 C126.1 C127.1 C128.2 C129.2 C130.2 C133.1 C134.1 C135.1 C136.1 C138.1 C142.1 R50.2 U5.6(COM) U5.10(GND) U7.13(REF-) U8.13(REF-) U9.8(GND) U29.7(GND) U31.2(GND) U31.3(B0) U32.8(GND) U33.8(GND) U34.8(GND) U35.8(GND) U36.8(GND) U37.8(GND) U38.8(GND) U40.2(GND) U41.2(GND) U42.8(GND) U43.8(GND) U44.8(GND) U45.8(GND) U46.8(GND) U47.8(GND) U48.2(Y6) U48.4(Y7) U48.5(Y5) U48.8(GND) U49.12(GND) U49.27(VSS) U50.9(GND) U51.9(GND) U52.2(DGND) U53.12(GND) U53.27(VSS) U55.9(GND) U56.2(GND) U56.3(GND) U57.2(GND) U57.3(GND) U58.2(GND) U58.3(GND) U59.2(GND) U59.3(GND) U60.8(VSSA/VREF-) U60.23(VSS) U60.35(VSS) U60.47(VSS) U60.49(EP)
V1_1: U48.1(Y4) U49.4(S16) U49.5(S15) U50.1(S16) U50.2(S15) U51.1(S16) U51.2(S15) U53.4(S16) U53.5(S15) U55.1(S16) U55.2(S15)
v1_1: CN1.2 CN1.4 CN1.6
V1_2: U32.13(Y0)
v1_2: H4.1
V1_3: U33.15(Y2)
v1_3: H4.3
V1_4: U34.1(Y4)
v1_4: H4.5
V1_5: U35.2(Y6)
v1_5: H4.7
V1_6: U46.13(Y0)
v1_6: H4.9
V1_7: U47.15(Y2)
v1_7: H4.11
V2_2: U32.14(Y1)
v2_2: H4.13
V2_3: U33.12(Y3)
v2_3: H4.15
V2_4: U34.5(Y5)
v2_4: H4.17
V2_5: U35.4(Y7)
v2_5: H4.19
V2_6: U46.14(Y1)
v2_6: H4.21
V2_7: U47.12(Y3)
v2_7: H4.23
V3_2: U32.15(Y2)
v3_2: H4.25
V3_3: U33.1(Y4)
v3_3: H4.27
V3_4: U34.2(Y6)
v3_4: H4.29
V3_5: U45.13(Y0)
v3_5: H4.31
V3_6: U46.15(Y2)
v3_6: H4.33
V3_7: U47.1(Y4)
v3_7: H4.35
V4_2: U32.12(Y3)
v4_2: H4.37
V4_3: U33.5(Y5)
v4_3: H4.39
V4_4: U34.4(Y7)
v4_4: H4.41
V4_5: U45.14(Y1)
v4_5: H4.43
V4_6: U46.12(Y3)
v4_6: H4.45
V4_7: U47.5(Y5)
v4_7: H4.47
V5_2: U32.1(Y4)
v5_2: H4.49
V5_3: U33.2(Y6)
v5_3: H4.51
V5_4: U44.13(Y0)
v5_4: H4.53
V5_5: U45.15(Y2)
v5_5: H4.55
V5_6: U46.1(Y4)
v5_6: H4.57
V5_7: U47.2(Y6)
v5_7: H4.59
V6_2: U32.5(Y5)
v6_2: H4.61
V6_3: U33.4(Y7)
v6_3: H4.63
V6_4: U44.14(Y1)
v6_4: H4.2
V6_5: U45.12(Y3)
v6_5: H4.4
V6_6: U46.5(Y5)
v6_6: H4.6
V6_7: U47.4(Y7)
v6_7: H4.8
V7_2: U32.2(Y6)
v7_2: H4.10
V7_3: U43.13(Y0)
v7_3: H4.12
V7_4: U44.15(Y2)
v7_4: H4.14
V7_5: U45.1(Y4)
v7_5: H4.16
V7_6: U46.2(Y6)
v7_6: H4.18
V7_7: U38.13(Y0)
v7_7: H4.20
V8_2: U32.4(Y7)
v8_2: H4.22
V8_3: U43.14(Y1)
v8_3: H4.24
V8_4: U44.12(Y3)
v8_4: H4.26
V8_5: U45.5(Y5)
v8_5: H4.28
V8_6: U46.4(Y7)
v8_6: H4.30
V8_7: U38.14(Y1)
v8_7: H4.32
V9_2: U42.13(Y0)
v9_2: H4.34
V9_3: U43.15(Y2)
v9_3: H4.36
V9_4: U44.1(Y4)
v9_4: H4.38
V9_5: U45.2(Y6)
v9_5: H4.40
V9_6: U37.13(Y0)
v9_6: H4.42
V9_7: U38.15(Y2)
v9_7: H4.44
V10_2: U42.14(Y1)
v10_2: H4.46
V10_3: U43.12(Y3)
v10_3: H4.48
V10_4: U44.5(Y5)
v10_4: H4.50
V10_5: U45.4(Y7)
v10_5: H4.52
V10_6: U37.14(Y1)
v10_6: H4.54
V10_7: U38.12(Y3)
v10_7: H4.56
V11_2: U42.15(Y2)
v11_2: H5.63
V11_3: U43.1(Y4)
v11_3: H5.61
V11_4: U44.2(Y6)
v11_4: H5.59
V11_5: U36.13(Y0)
v11_5: H5.57
V11_6: U37.15(Y2)
v11_6: H5.55
V11_7: U38.1(Y4)
v11_7: H5.53
V12_2: U42.12(Y3)
v12_2: H5.51
V12_3: U43.5(Y5)
v12_3: H5.49
V12_4: U44.4(Y7)
v12_4: H5.47
V12_5: U36.14(Y1)
v12_5: H5.45
V12_6: U37.12(Y3)
v12_6: H5.43
V12_7: U38.5(Y5)
v12_7: H5.41
V13_2: U42.1(Y4)
v13_2: H5.39
V13_3: U43.2(Y6)
v13_3: H5.37
V13_4: U35.13(Y0)
v13_4: H5.35
V13_5: U36.15(Y2)
v13_5: H5.33
V13_6: U37.1(Y4)
v13_6: H5.31
V13_7: U38.2(Y6)
v13_7: H5.29
V14_2: U42.5(Y5)
v14_2: H5.27
V14_3: U43.4(Y7)
v14_3: H5.25
V14_4: U35.14(Y1)
v14_4: H5.23
V14_5: U36.12(Y3)
v14_5: H5.21
V14_6: U37.5(Y5)
v14_6: H5.19
V14_7: U38.4(Y7)
v14_7: H5.17
V15_2: U42.2(Y6)
v15_2: H5.15
V15_3: U34.13(Y0)
v15_3: H5.13
V15_4: U35.15(Y2)
v15_4: H5.11
V15_5: U36.1(Y4)
v15_5: H5.9
V15_6: U37.2(Y6)
v15_6: H5.7
V15_7: U48.13(Y0)
v15_7: H5.5
V16_2: U42.4(Y7)
v16_2: H5.3
V16_3: U34.14(Y1)
v16_3: H5.1
V16_4: U35.12(Y3)
v16_4: H5.34
V16_5: U36.5(Y5)
v16_5: H5.64
V16_6: U37.4(Y7)
v16_6: H5.62
V16_7: U48.14(Y1)
v16_7: H5.60
V17_2: U33.13(Y0)
v17_2: H5.58
V17_3: U34.15(Y2)
v17_3: H5.56
V17_4: U35.1(Y4)
v17_4: H5.54
V17_5: U36.2(Y6)
v17_5: H5.52
V17_6: U47.13(Y0)
v17_6: H5.50
V17_7: U48.15(Y2)
v17_7: H5.48
V18_2: U33.14(Y1)
v18_2: H5.46
V18_3: U34.12(Y3)
v18_3: H5.44
V18_4: U35.5(Y5)
v18_4: H5.42
V18_5: U36.4(Y7)
v18_5: H5.40
V18_6: U47.14(Y1)
v18_6: H5.38
V18_7: U48.12(Y3)
v18_7: H5.36
VCC_F_1: C22.1 U10.8(VCC)
VCC_F_2: C24.1 U11.8(VCC)
VCC_F_3: C26.1 U12.8(VCC)
VCC_F_4: C28.1 U13.8(VCC)
VCC_F_5: C30.1 U14.8(VCC)
VCC_F_6: C32.1 U15.8(VCC)
VCC_F_7: C34.1 U16.8(VCC)
VCC_F_8: C36.1 U17.8(VCC)
VCC_F_9: C38.1 U18.8(VCC)
VCC_F_10: C40.1 U19.8(VCC)
VCC_F_11: C42.1 U20.8(VCC)
VCC_F_12: C44.1 U21.8(VCC)
VCC_F_13: C46.1 U22.8(VCC)
VCC_F_14: C48.1 U23.8(VCC)
VCC_F_15: C50.1 U24.8(VCC)
VCC_F_16: C52.1 U25.8(VCC)
VCC_F_17: C54.1 U26.8(VCC)
VCC_F_18: C56.1 U27.8(VCC)
+p1 battery: D19.1(K) Q1.2(S)
+p2_battery: D20.1(K) Q2.2(S)
+p3_battery: D21.1(K) Q3.2(S)
+p4_battery: D22.1(K) Q4.2(S)
+p5_battery: D23.1(K) Q5.2(S)
+p6_battery: D24.1(K) Q6.2(S)
+p7_battery: D25.1(K) Q7.2(S)
+p9_battery: D27.1(K) Q9.2(S)
+p10_battery: D28.1(K) Q10.2(S)
+p11_battery: D29.1(K) Q11.2(S)
+p12_battery: D30.1(K) Q12.2(S)
+p13_battery: D31.1(K) Q13.2(S)
+p14 battery: D32.1(K) Q14.2(S)
+p15_battery: D33.1(K) Q15.2(S)
+p16_battery: D34.1(K) Q16.2(S)
+p17_battery: D35.1(K) Q17.2(S)
+p18_battery: D36.1(K) Q18.2(S)
+p_8battery: D26.1(K) Q8.2(S)
-bat_sw: D40.2(A) D41.2(A) Q19.4(S) Q20.4(S) R61.1 R62.1
A_INA: R58.2 U29.3(ALERT)
AB: D41.1(K) Q20.1(D) Q20.2(D) Q20.5(D) Q20.6(D)
AB_E: D38.1(K) R60.2 U59.24(P27)
Boot_mk: R99.1 U60.44(BOOT0)
Bt_mk: BT1.1(+) U60.1(VBAT)
charger_block: C18.1 R67.2 RSH1.1
Circ_1_in: U10.1(IP+) U10.2(IP+)
Circ_1_out: U10.3(IP-) U10.4(IP-)
Circ_1_to_ADC: U8.1(AIN0) U10.7(VIOUT)
Circ_2_in: U11.1(IP+) U11.2(IP+)
Circ_2_out: U11.3(IP-) U11.4(IP-)
Circ_2_to_ADC: U8.2(AIN1) U11.7(VIOUT)
Circ_3_in: U12.1(IP+) U12.2(IP+)
Circ_3_out: U12.3(IP-) U12.4(IP-)
Circ_3_to_ADC: U8.3(AIN2) U12.7(VIOUT)
Circ_4_in: U13.1(IP+) U13.2(IP+)
Circ_4_out: U13.3(IP-) U13.4(IP-)
Circ_4_to_ADC: U8.4(AIN3) U13.7(VIOUT)
Circ_5_in: U14.1(IP+) U14.2(IP+)
Circ_5_out: U14.3(IP-) U14.4(IP-)
Circ_5_to_ADC: U8.5(AIN4) U14.7(VIOUT)
Circ_6_in: U15.1(IP+) U15.2(IP+)
Circ_6_out: U15.3(IP-) U15.4(IP-)
Circ_6_to_ADC: U8.6(AIN5) U15.7(VIOUT)
Circ_7_in: U16.1(IP+) U16.2(IP+)
Circ_7_out: U16.3(IP-) U16.4(IP-)
Circ_7_to_ADC: U8.7(AIN6) U16.7(VIOUT)
Circ_8_in: U17.1(IP+) U17.2(IP+)
Circ_8_out: U17.3(IP-) U17.4(IP-)
Circ_8_to_ADC: U8.8(AIN7) U17.7(VIOUT)
Circ_9_in: U18.1(IP+) U18.2(IP+)
Circ_9_out: U18.3(IP-) U18.4(IP-)
Circ_9_to_ADC: U8.9(AIN8) U18.7(VIOUT)
Circ_10_in: U19.1(IP+) U19.2(IP+)
Circ_10_out: U19.3(IP-) U19.4(IP-)
Circ_10_to_ADC: U8.11(AIN9) U19.7(VIOUT)
Circ_11_in: U20.1(IP+) U20.2(IP+)
Circ_11_out: U20.3(IP-) U20.4(IP-)
Circ_11_to_ADC: U8.12(AIN10) U20.7(VIOUT)
Circ_12_in: U21.1(IP+) U21.2(IP+)
Circ_12_out: U21.3(IP-) U21.4(IP-)
Circ_12_to_ADC: U7.1(AIN0) U21.7(VIOUT)
Circ_13_in: U22.1(IP+) U22.2(IP+)
Circ_13_out: U22.3(IP-) U22.4(IP-)
Circ_13_to_ADC: U7.2(AIN1) U22.7(VIOUT)
Circ_14_in: U23.1(IP+) U23.2(IP+)
Circ_14_out: U23.3(IP-) U23.4(IP-)
Circ_14_to_ADC: U7.3(AIN2) U23.7(VIOUT)
Circ_15_in: U24.1(IP+) U24.2(IP+)
Circ_15_out: U24.3(IP-) U24.4(IP-)
Circ_15_to_ADC: U7.4(AIN3) U24.7(VIOUT)
Circ_16_in: U25.1(IP+) U25.2(IP+)
Circ_16_out: U25.3(IP-) U25.4(IP-)
Circ_16_to_ADC: U7.5(AIN4) U25.7(VIOUT)
Circ_17_in: U26.1(IP+) U26.2(IP+)
Circ_17_out: U26.3(IP-) U26.4(IP-)
Circ_17_to_ADC: U7.6(AIN5) U26.7(VIOUT)
Circ_18_in: U27.1(IP+) U27.2(IP+)
Circ_18_out: U27.3(IP-) U27.4(IP-)
Circ_18_to_ADC: U7.7(AIN6) U27.7(VIOUT)
CLK_enc: H2.1 U59.16(P19)
CM_F_1: C21.1 U10.6(FILTER)
CM_F_2: C23.1 U11.6(FILTER)
CM_F_3: C25.1 U12.6(FILTER)
CM_F_4: C27.1 U13.6(FILTER)
CM_F_5: C29.1 U14.6(FILTER)
CM_F_6: C31.1 U15.6(FILTER)
CM_F_7: C33.1 U16.6(FILTER)
CM_F_8: C35.1 U17.6(FILTER)
CM_F_9: C37.1 U18.6(FILTER)
CM_F_10: C39.1 U19.6(FILTER)
CM_F_11: C41.1 U20.6(FILTER)
CM_F_12: C43.1 U21.6(FILTER)
CM_F_13: C45.1 U22.6(FILTER)
CM_F_14: C47.1 U23.6(FILTER)
CM_F_15: C49.1 U24.6(FILTER)
CM_F_16: C51.1 U25.6(FILTER)
CM_F_17: C53.1 U26.6(FILTER)
CM_F_18: C55.1 U27.6(FILTER)
DSP_DC: FPC1.5 R7.1
DSP_DC_R: R7.2 U59.14(P17)
DSP_RST: FPC1.4 R6.1
DSP_RST_R: R6.2 U59.13(P16)
DT_enc: H2.2 U59.17(P20)
E_RG#: R50.1 U9.13(OE#)
Ens8_1: R80.1 U32.6(E#)
Ens8_1_R: R80.2 U57.15(P18)
Ens8_2: R81.1 U42.6(E#)
Ens8_2_R: R81.2 U57.16(P19)
Ens8_3: R82.1 U33.6(E#)
Ens8_3_R: R82.2 U57.17(P20)
Ens8_4: R83.1 U43.6(E#)
Ens8_4_R: R83.2 U57.18(P21)
Ens8_5: R84.1 U34.6(E#)
Ens8_5_R: R84.2 U57.19(P22)
Ens8_6: R85.1 U44.6(E#)
Ens8_6_R: R85.2 U57.20(P23)
Ens8_7: R86.1 U35.6(E#)
Ens8_7_R: R86.2 U57.21(P24)
Ens8_8: R87.1 U45.6(E#)
Ens8_8_R: R87.2 U57.22(P25)
Ens8_9: R88.1 U36.6(E#)
Ens8_9_R: R88.2 U57.23(P26)
Ens8_10: R89.1 U46.6(E#)
Ens8_10_R: R89.2 U57.24(P27)
Ens8_11: R90.1 U37.6(E#)
Ens8_11_R: R90.2 U57.25(P28)
Ens8_12: R91.1 U47.6(E#)
Ens8_12_R: R91.2 U57.27(P29)
Ens8_13: R92.1 U38.6(E#)
Ens8_13_R: R92.2 U57.29(P30)
Ens8_14: R93.1 U48.6(E#)
Ens8_14_R: R93.2 U57.31(P31)
Ens16_B+: R78.1 U50.16(EN)
Ens16_B-: R77.1 U51.16(EN)
Ens16_B/: R79.1 U55.16(EN)
Ens16_B_R: R77.2 R78.2 R79.2 U56.22(P25)
Ens16_V+: R75.1 U49.18(EN)
Ens16_V-: R76.1 U53.18(EN)
Ens16_V_R: R75.2 R76.2 U56.21(P24)
f1_node: D19.2(A) F1.1 Q1.3(D)
fl_node: C12.1 D20.2(A) D21.2(A) D22.2(A) D23.2(A) D24.2(A) D25.2(A) D26.2(A) D27.2(A) D28.2(A) D29.2(A) D30.2(A) D31.2(A) D32.2(A) D33.2(A) D34.2(A) D35.2(A) D36.2(A) Q2.3(D) Q3.3(D) Q4.3(D) Q5.3(D) Q6.3(D) Q7.3(D) Q8.3(D) Q9.3(D) Q10.3(D) Q11.3(D) Q12.3(D) Q13.3(D) Q14.3(D) Q15.3(D) Q16.3(D) Q17.3(D) Q18.3(D) U28.1(VIN)
im_e: R13.2 U7.19(EOC) U8.19(EOC) U59.29(P30)
ind_1: U9.11(SHCP) U59.19(P22)
ind_2: U9.12(STCP) U59.20(P23)
ind_3: U9.14(DS) U59.21(P24)
InS1_1: U32.11(S1) U58.32(P4)
InS1_2: U32.10(S2) U58.30(P5)
InS1_3: U32.9(S3) U58.28(P6)
InS2_1: U42.11(S1) U58.26(P7)
InS2_2: U42.10(S2) U58.5(P8)
InS2_3: U42.9(S3) U58.7(P9)
InS3_1: U33.11(S1) U58.9(P10)
InS3_2: U33.10(S2) U58.11(P11)
InS3_3: U33.9(S3) U58.6(P12)
InS4_1: U43.11(S1) U58.8(P13)
InS4_2: U43.10(S2) U58.10(P14)
InS4_3: U43.9(S3) U58.12(P15)
InS5_1: U34.11(S1) U58.13(P16)
InS5_2: U34.10(S2) U58.14(P17)
InS5_3: U34.9(S3) U58.15(P18)
InS6_1: U44.11(S1) U58.16(P19)
InS6_2: U44.10(S2) U58.17(P20)
InS6_3: U44.9(S3) U58.18(P21)
InS7_1: U35.11(S1) U58.19(P22)
InS7_2: U35.10(S2) U58.20(P23)
InS7_3: U35.9(S3) U58.21(P24)
InS8_1: U45.11(S1) U58.22(P25)
InS8_2: U45.10(S2) U58.23(P26)
InS8_3: U45.9(S3) U58.24(P27)
InS9_1: U36.11(S1) U58.25(P28)
InS9_2: U36.10(S2) U58.27(P29)
InS9_3: U36.9(S3) U58.29(P30)
InS10_1: U46.11(S1) U58.31(P31)
InS10_2: U46.10(S2) U57.32(P4)
InS10_3: U46.9(S3) U57.30(P5)
InS11_1: U37.11(S1) U57.28(P6)
InS11_2: U37.10(S2) U57.26(P7)
InS11_3: U37.9(S3) U57.5(P8)
InS12_1: U47.11(S1) U57.7(P9)
InS12_2: U47.10(S2) U57.9(P10)
InS12_3: U47.9(S3) U57.11(P11)
InS13_1: U38.11(S1) U57.6(P12)
InS13_2: U38.10(S2) U57.8(P13)
InS13_3: U38.9(S3) U57.10(P14)
InS14_1: U48.11(S1) U57.12(P15)
InS14_2: U48.10(S2) U57.13(P16)
InS14_3: U48.9(S3) U57.14(P17)
InS16B+_1: U50.15(A0) U56.32(P4)
InS16B+_2: U50.14(A1) U56.30(P5)
InS16B+_3: U50.11(A2) U56.28(P6)
InS16B+_4: U50.10(A3) U56.26(P7)
InS16B-_1: U51.15(A0) U56.5(P8)
InS16B-_2: U51.14(A1) U56.7(P9)
InS16B-_3: U51.11(A2) U56.9(P10)
InS16B-_4: U51.10(A3) U56.11(P11)
InS16B/_1: U55.15(A0) U56.6(P12)
InS16B/_2: U55.14(A1) U56.8(P13)
InS16B/_3: U55.11(A2) U56.10(P14)
InS16B/_4: U55.10(A3) U56.12(P15)
InS16V+_1: U49.17(A0) U56.13(P16)
InS16V+_2: U49.16(A1) U56.14(P17)
InS16V+_3: U49.15(A2) U56.15(P18)
InS16V+_4: U49.14(A3) U56.16(P19)
InS16V-_1: U53.17(A0) U56.17(P20)
InS16V-_2: U53.16(A1) U56.18(P21)
InS16V-_3: U53.15(A2) U56.19(P22)
InS16V-_4: U53.14(A3) U56.20(P23)
Iset1: R98.2 U58.1(ISET)
Iset2: R102.2 U57.1(ISET)
Iset3: R103.2 U56.1(ISET)
Iset4: R104.2 U59.1(ISET)
NRST: C141.2 KEY2.2 U60.7(NRST)
OSC_In: C131.1 U60.5(PH0-OSC_IN) U61.P$1(PIN1)
OSC_In32: C140.1 U60.3(PC14-OSC32_IN) U62.P$1(PIN1)
OSC_OUT: C132.1 U60.6(PH1-OSC_OUT) U61.P$2(PIN2)
OSC_OUT32: C139.1 U60.4(PC15-OSC32_OUT) U62.P$2(PIN2)
Outs8_1: U32.3(Z) U49.19(S1) U50.17(S1) U51.17(S1) U53.19(S1) U55.17(S1)
Outs8_2: U42.3(Z) U49.20(S2) U50.18(S2) U51.18(S2) U53.20(S2) U55.18(S2)
Outs8_3: U33.3(Z) U49.21(S3) U50.19(S3) U51.19(S3) U53.21(S3) U55.19(S3)
Outs8_4: U43.3(Z) U49.22(S4) U50.20(S4) U51.20(S4) U53.22(S4) U55.20(S4)
Outs8_5: U34.3(Z) U49.23(S5) U50.21(S5) U51.21(S5) U53.23(S5) U55.21(S5)
Outs8_6: U44.3(Z) U49.24(S6) U50.22(S6) U51.22(S6) U53.24(S6) U55.22(S6)
Outs8_7: U35.3(Z) U49.25(S7) U50.23(S7) U51.23(S7) U53.25(S7) U55.23(S7)
Outs8_8: U45.3(Z) U49.26(S8) U50.24(S8) U51.24(S8) U53.26(S8) U55.24(S8)
Outs8_9: U36.3(Z) U49.11(S9) U50.8(S9) U51.8(S9) U53.11(S9) U55.8(S9)
Outs8_10: U46.3(Z) U49.10(S10) U50.7(S10) U51.7(S10) U53.10(S10) U55.7(S10)
Outs8_11: U37.3(Z) U49.9(S11) U50.6(S11) U51.6(S11) U53.9(S11) U55.6(S11)
Outs8_12: U47.3(Z) U49.8(S12) U50.5(S12) U51.5(S12) U53.8(S12) U55.5(S12)
Outs8_13: U38.3(Z) U49.7(S13) U50.4(S13) U51.4(S13) U53.7(S13) U55.4(S13)
Outs8_14: U48.3(Z) U49.6(S14) U50.3(S14) U51.3(S14) U53.6(S14) U55.3(S14)
OutS16_B+: C14.1 D43.1(C) D45.1(C) Q22.3(S2) R69.1 U50.29(D)
OutS16_B-: C15.2 D44.2(A) D46.2(A) Q22.1(S1) R70.1 U51.29(D)
OutS16_B/: C14.2 C15.1 L1.1 R64.1 U55.29(D)
OutS16B+: C13.1 R63.1
OutS16V+: R95.1 U49.28(D)
OutS16V-: R94.1 U53.28(D)
p1_en: D1.2(A) R14.2 U56.23(P26)
p2_en: D2.2(A) R15.2 U56.24(P27)
p3_en: D3.2(A) R16.2 U56.25(P28)
p4_en: D4.2(A) R17.2 U56.27(P29)
p5_en: D5.2(A) R18.2 U56.29(P30)
p6_en: D6.2(A) R19.2 U56.31(P31)
p7_en: D7.2(A) R20.2 U59.32(P4)
p8_en: D8.2(A) R21.2 U59.30(P5)
p9_en: D9.2(A) R22.2 U59.28(P6)
p10_en: D10.2(A) R23.2 U59.26(P7)
p11_en: D11.2(A) R24.2 U59.5(P8)
p12_en: D12.2(A) R25.2 U59.7(P9)
p13_en: D13.2(A) R26.2 U59.9(P10)
p14_en: D14.2(A) R27.2 U59.11(P11)
p15_en: D15.2(A) R28.2 U59.6(P12)
p16_en: D16.2(A) R29.2 U59.8(P13)
p17_en: D17.2(A) R30.2 U59.10(P14)
p18_en: D18.2(A) R31.2 U59.12(P15)
PB: C13.2 D39.1(K) D40.1(K) Q19.1(D) Q19.2(D) Q19.5(D) Q19.6(D) Q21.3(D)
PB_E: D37.1(K) R59.2 U59.23(P26)
PC13: C137.2 KEY1.2 R101.1 U60.2(PC13-ANTI_TAMP)
power_switch: C18.2 C98.2 D49.2(A) Q24.3(S) R66.2 RSH1.2 U29.8(VBUS)
ps: R71.1 U59.25(P28)
psB: U31.6(S) U59.22(P25)
PWM_DOWN: U41.6(S)
PWM_Down: U60.13(PA3)
PWM_Up: U60.12(PA2)
PWM_UP: U40.6(S)
SPI1_MISO: U5.12(DOUT) U58.4(DOUT) U60.16(PA6)
SPI1_MOSI: U5.14(DIN) U58.34(DIN) U60.17(PA7)
SPI1_NSS1: U58.35(CS#) U60.14(PA4)
SPI1_NSS2: U5.15(CS) U60.30(PA9)
SPI1_SCK: U5.16(DCLK) U58.33(SCLK) U60.15(PA5)
SPI2_CSK: U7.15(CS#) U8.15(CS#)
SPI2_MISO: U7.16(DATA_OUT) U8.16(DATA_OUT) U57.4(DOUT) U60.27(PB14)
SPI2_MOSI: U7.17(DATA_INPUT) U8.17(DATA_INPUT) U57.34(DIN) U60.28(PB15)
SPI2_NSS1: U57.35(CS#) U60.46(PB9)
SPI2_NSS2: U7.18(I/O_CLOCK) U60.29(PA8)
SPI2_NSS3: U8.18(I/O_CLOCK) U60.42(PB6)
SPI2_SCK: U57.33(SCLK) U60.21(PB10)
SPI3_MISO: U52.1(DOUT) U56.4(DOUT) U60.40(PB4)
SPI3_MOSI: U56.34(DIN) U60.41(PB5)
SPI3_NSS1: U56.35(CS#) U60.38(PA15)
SPI3_NSS2: U52.10(SCLK) U60.10(PA0-WKUP) U60.43(PB7)
SPI3_SCK: U52.9(CS#) U56.33(SCLK) U60.39(PB3)
SPI4_MISO: U29.4(MISO) U59.4(DOUT) U60.32(PA11)
SPI4_MOSI: U29.2(MOSI) U59.34(DIN) U60.11(PA1)
SPI4_NSS1: U59.35(CS#) U60.25(PB12)
SPI4_NSS2: U29.1(CS) U60.45(PB8)
SPI4_SCK: U29.5(SCL) U59.33(SCLK) U60.26(PB13)
SPI5_MISO: FPC1.9 FPC1.13 U60.33(PA12)
SPI5_MOSI: FPC1.6 FPC1.12 U60.31(PA10)
SPI5_NSS1: FPC1.3 U60.19(PB1)
SPI5_NSS2: FPC1.11 U60.20(PB2)
SPI5_SCK: FPC1.7 FPC1.10 U60.18(PB0)
SW_enc: H2.3 U59.18(P21)
SYS_JTCK-SWCLK: U6.2 U60.37(PA14)
SYS_JTMS-SWD: U6.3 U60.34(PA13)
t1: C7.1 R1.2 R8.1 U1.1 U5.2(CH0)
t2: C8.1 R2.2 R9.1 U2.1 U5.3(CH1)
t3: C9.1 R3.2 R10.1 U3.1 U5.4(CH2)
t4: C10.1 R4.2 R11.1 U4.1 U5.5(CH3)
T_IRQ: FPC1.14 R5.1
T_IRQ_R: R5.2 U59.15(P18)
tm_busy: R12.1 U5.13(BUSY)
tm_busy_R: R12.2 U59.27(P29)
tm_e: R13.1 U5.7(SHDN)
V+1: C123.2 U58.36(V+)
V+2: C136.2 U57.36(V+)
V+3: C138.2 U56.36(V+)
V+4: C142.2 U59.36(V+)
V_CAP: C124.2 U60.22(VCAP-1)
v_msr_to_ADC: U52.5(AIN) U54.6(OUT)
v_stab: C112.1 C116.2 R97.1 U54.7(+VS)
Net-(C16-2): C16.2 U29.6(VS)
Net-(C20-2): C20.2 R68.1
Net-(C77-1): C77.1 U40.4(A)
Net-(C77-2): C77.2 D45.2(A) Q22.4(G2) R69.2
Net-(C78-1): C78.1 U41.4(A)
Net-(C78-2): C78.2 D46.1(C) Q22.2(G1) R70.2
Net-(C105-1): C105.1 U52.6(REF)
Net-(C107-1): C107.1 R94.2 U54.2(-IN)
Net-(C108-2): C108.2 R95.2 U54.3(+IN)
Net-(C137-1): C137.1 R100.2
Net-(D39-2): D39.2(A) Q21.2(S) R63.2
Net-(D42-1): D42.1 L2.1 U28.2(VOUT)
Net-(D43-2): D43.2(A) D44.1(C) Q22.5(D2) Q22.6(D2) Q22.7(D1) Q22.8(D1) U30.2
Net-(D47-1): D47.1(C) D49.1(C) F1.2 Q24.2(D) R68.2 R73.2
Net-(D48-2): D48.2 Q23.1(G) R71.2 R72.2
Net-(D50-1): D50.1(C) Q23.3(D) R74.1
Net-(L1-2): L1.2 R64.2 U30.1
Net-(LED1-1): LED1.1 R51.2
Net-(LED2-1): LED2.1 R52.2
Net-(LED3-1): LED3.1 R53.2
Net-(LED4-1): LED4.1 R54.2
Net-(LED5-1): LED5.1 R55.2
Net-(LED6-1): LED6.1 R56.2
Net-(LED7-1): LED7.1 R57.2
Net-(Q1-1): Q1.1(G) R14.1 R32.1
Net-(Q2-1): Q2.1(G) R15.1 R33.1
Net-(Q3-1): Q3.1(G) R16.1 R34.1
Net-(Q4-1): Q4.1(G) R17.1 R35.1
Net-(Q5-1): Q5.1(G) R18.1 R36.1
Net-(Q6-1): Q6.1(G) R19.1 R37.1
Net-(Q7-1): Q7.1(G) R20.1 R38.1
Net-(Q8-1): Q8.1(G) R21.1 R39.1
Net-(Q9-1): Q9.1(G) R22.1 R40.1
Net-(Q10-1): Q10.1(G) R23.1 R41.1
Net-(Q11-1): Q11.1(G) R24.1 R42.1
Net-(Q12-1): Q12.1(G) R25.1 R43.1
Net-(Q13-1): Q13.1(G) R26.1 R44.1
Net-(Q14-1): Q14.1(G) R27.1 R45.1
Net-(Q15-1): Q15.1(G) R28.1 R46.1
Net-(Q16-1): Q16.1(G) R29.1 R47.1
Net-(Q17-1): Q17.1(G) R30.1 R48.1
Net-(Q18-1): Q18.1(G) R31.1 R49.1
Net-(Q19-3): Q19.3(G) R59.1 R61.2
Net-(Q20-3): Q20.3(G) R60.1 R62.2
Net-(Q21-1): Q21.1(G) R65.1
Net-(Q24-1): Q24.1(G) R73.1 R74.2
Net-(R51-1): R51.1 U9.7(Q7)
Net-(R52-1): R52.1 U9.6(Q6)
Net-(R53-1): R53.1 U9.5(Q5)
Net-(R54-1): R54.1 U9.4(Q4)
Net-(R55-1): R55.1 U9.3(Q3)
Net-(R56-1): R56.1 U9.2(Q2)
Net-(R57-1): R57.1 U9.1(Q1)
Net-(R65-2): R65.2 U31.4(A)
Net-(R66-1): R66.1 U29.10(IN+)
Net-(R67-1): R67.1 U29.9(IN-)
Net-(R96-1): R96.1 U54.1(REF)
Net-(R97-2): R97.2 U54.5(SENSE)

Not connected (* = marked no-connect by the designer): H4 58 60 62 64; H5 2 4 6 8 10 12 14 16 18 20 22 24 26 28 30 32; U7 11(AIN9)* 12(AIN10)*; U9 9(Q7S)* 15(Q0)*; U32 7(NC)*; U33 7(NC)*; U34 7(NC)*; U35 7(NC)*; U36 7(NC)*; U37 7(NC)*; U38 7(NC)*; U42 7(NC)*; U43 7(NC)*; U44 7(NC)*; U45 7(NC)*; U46 7(NC)*; U47 7(NC)*; U48 7(NC)*; U49 2(NC)* 3(NC)* 13(NC)*; U50 12(NC)* 13(NC)* 26(NC)* 27(NC)* 28(NC)* 30(NC)* 32(NC)*; U51 12(NC)* 13(NC)* 26(NC)* 27(NC)* 28(NC)* 30(NC)* 32(NC)*; U53 2(NC)* 3(NC)* 13(NC)*; U54 8(NC)*; U55 12(NC)* 13(NC)* 26(NC)* 27(NC)* 28(NC)* 30(NC)* 32(NC)*

## Notes on the sheet
- System interface
- System indication
- Unit of load switch
- Voltage measurement on each element
- ADC of voltage measurement
- Temperature measurement
- ADC circuit measurement
- Mesurement of circuit
- Unit of commutation
- SW
- SW
- MK with ports expander and binding element
- SW
- SW
- SW
- SW
- sw
- SW
- SW
- SW
- SW
- sw
- sw
- SW
- SW
- SW
- SW
- sw
- sw
- ADC temperature sensors
- Unit of input and output control
- p assembly switch point
- Balancing switch
- Passive balancing
- Active balancing
- Stabilization 5V
- Stabilization 3,3V
- Bipolar power supply +/-5V
